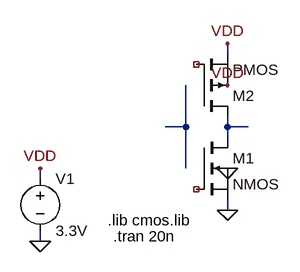
[diagram p0: schematic ring-oscillator-homework.asc]
ring-oscillator-homework.asc, the LTspice schematic file:
Version 4
SHEET 1 1292 680
WIRE -624 -48 -624 -64
WIRE -688 64 -688 0
WIRE -688 64 -720 64
WIRE -624 64 -624 48
WIRE -592 64 -624 64
WIRE -624 80 -624 64
WIRE -688 128 -688 64
WIRE -912 144 -912 128
WIRE -624 192 -624 176
WIRE -912 240 -912 224
FLAG -624 192 0
FLAG -912 240 0
FLAG -912 128 VDD
FLAG -624 -64 VDD
FLAG -624 0 VDD
FLAG -624 128 0
SYMBOL voltage -912 128 R0
WINDOW 123 0 0 Left 2
WINDOW 39 0 0 Left 2
SYMATTR InstName V1
SYMATTR Value 3.3V
SYMBOL pmos -672 48 M180
WINDOW 39 56 100 Left 2
WINDOW 40 56 128 Left 2
SYMATTR InstName M2
SYMATTR Value2 l=0.6u w=1.8u
SYMATTR SpiceModel ""
SYMATTR Value PMOS
SYMBOL nmos -672 80 R0
SYMATTR InstName M1
SYMATTR Value2 l=0.6u w=0.9u
SYMATTR Value NMOS
TEXT -808 208 Left 2 !.lib cmos.lib
TEXT -800 232 Left 2 !.tran 20n

The netlist it stands for:
* ring-oscillator-homework.asc
V1 VDD 0 3.3V
* M2: PMOS l=0.6u w=1.8u (symbol pmos not certain, pin order unknown); nets seen at it: N002, VDD
* M1: NMOS l=0.6u w=0.9u (symbol nmos not certain, pin order unknown); nets seen at it: 0, N002
.lib cmos.lib
.tran 20n
.backanno
.end